# EAGLE design ATMEGA168 (EAGLE 6.4)
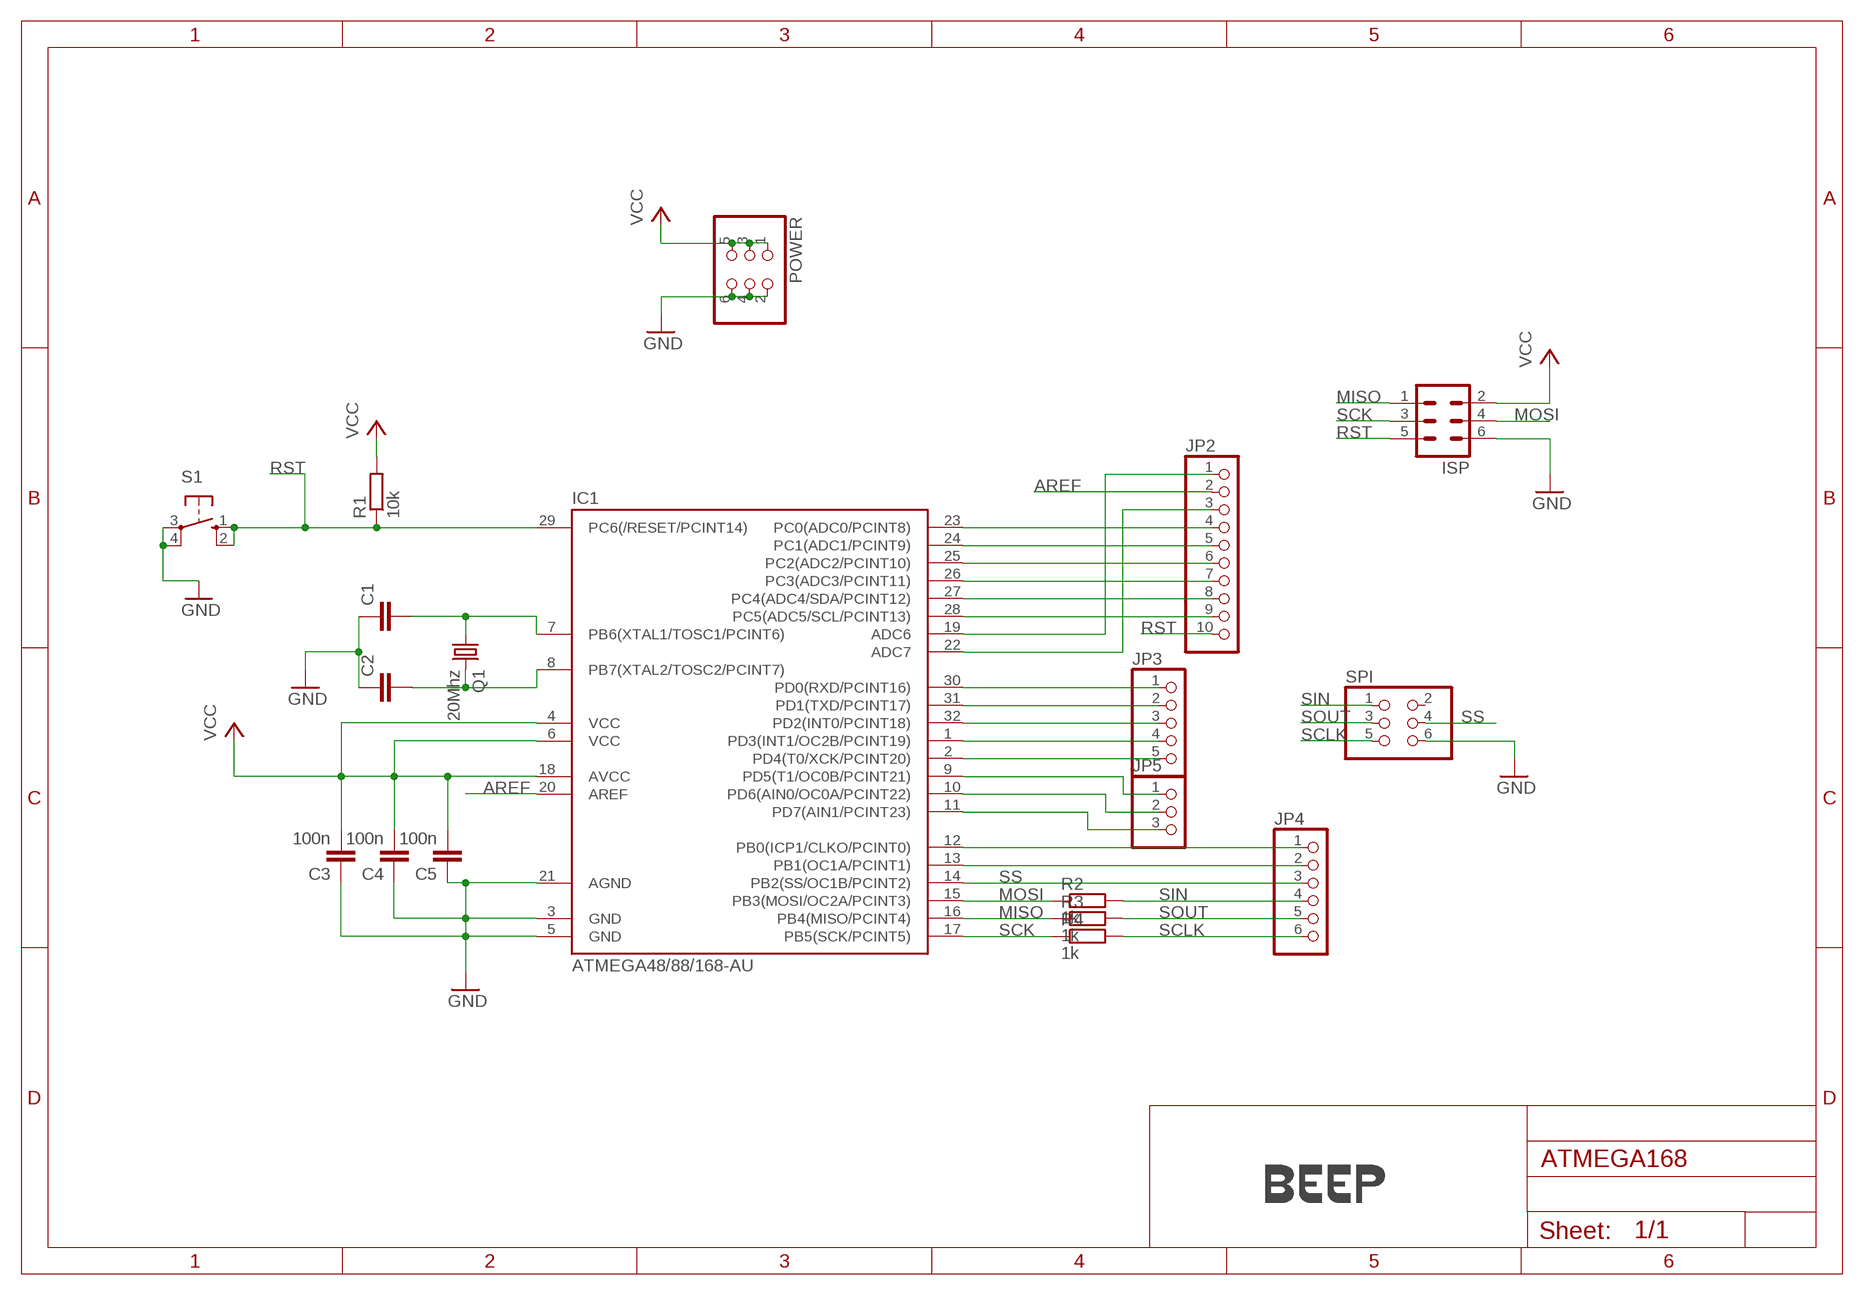
[diagram p0: schematic, sheet 1]

## Parts
C1  C-EUC0805  [C0805]
C2  C-EUC0805  [C0805]
C3  100n  C-EUC0805  [C0805]
C4  100n  C-EUC0805  [C0805]
C5  100n  C-EU050-025X075  [C050-025X075]
IC1  ATMEGA48/88/168-AU  [TQFP32-08]
ISP  ML6  [ML6]
JP2  PINHD-1X10  [1X10]
JP3  PINHD-1X5  [1X05]
JP4  PINHD-1X6  [1X06]
JP5  PINHD-1X3  [1X03]
POWER  PINHD-2X3  [2X03]
Q1  20Mhz  CRYSTALHC49S  [HC49/S]
R1  10k  R-EU_M0805  [M0805]
R2  1k  R-EU_0207/7  [0207/7]
R3  1k  R-EU_0207/7  [0207/7]
R4  1k  R-EU_0207/7  [0207/7]
S1  10-XX  [B3F-10XX]
SPI  PINHD-2X3  [2X03]
U$1  LOGO-COPPER4  [COPPER4]

## Nets
AREF: IC1.20(AREF) JP2.2
GND: C1.1 C2.1 C3.1 C4.1 C5.1 IC1.3(GND) IC1.5(GND) IC1.21(AGND) ISP.6 POWER.2 POWER.4 POWER.6 S1.3(P) S1.4(P1) SPI.6
MISO: IC1.16(PB4(MISO/PCINT4)) ISP.1 R3.1
MOSI: IC1.15(PB3(MOSI/OC2A/PCINT3)) ISP.4 R2.1
N$1: C1.2 IC1.7(PB6(XTAL1/TOSC1/PCINT6)) Q1.1
N$2: C2.2 IC1.8(PB7(XTAL2/TOSC2/PCINT7)) Q1.2
N$3: IC1.28(PC5(ADC5/SCL/PCINT13)) JP2.9
N$4: IC1.27(PC4(ADC4/SDA/PCINT12)) JP2.8
N$5: IC1.26(PC3(ADC3/PCINT11)) JP2.7
N$6: IC1.25(PC2(ADC2/PCINT10)) JP2.6
N$7: IC1.9(PD5(T1/OC0B/PCINT21)) JP5.1
N$8: IC1.10(PD6(AIN0/OC0A/PCINT22)) JP5.2
N$9: IC1.30(PD0(RXD/PCINT16)) JP3.1
N$10: IC1.31(PD1(TXD/PCINT17)) JP3.2
N$11: IC1.32(PD2(INT0/PCINT18)) JP3.3
N$12: IC1.1(PD3(INT1/OC2B/PCINT19)) JP3.4
N$13: IC1.2(PD4(T0/XCK/PCINT20)) JP3.5
N$14: IC1.11(PD7(AIN1/PCINT23)) JP5.3
N$15: IC1.24(PC1(ADC1/PCINT9)) JP2.5
N$16: IC1.23(PC0(ADC0/PCINT8)) JP2.4
N$17: IC1.12(PB0(ICP1/CLKO/PCINT0)) JP4.1
N$18: IC1.13(PB1(OC1A/PCINT1)) JP4.2
N$20: IC1.19(ADC6) JP2.1
N$21: IC1.22(ADC7) JP2.3
RST: IC1.29(PC6(/RESET/PCINT14)) ISP.5 JP2.10 R1.1 S1.1(S) S1.2(S1)
SCK: IC1.17(PB5(SCK/PCINT5)) ISP.3 R4.1
SCLK: JP4.6 R4.2 SPI.5
SIN: JP4.4 R2.2 SPI.1
SOUT: JP4.5 R3.2 SPI.3
SS: IC1.14(PB2(SS/OC1B/PCINT2)) JP4.3 SPI.4
VCC: C3.2 C4.2 C5.2 IC1.4(VCC) IC1.6(VCC) IC1.18(AVCC) ISP.2 POWER.1 POWER.3 POWER.5 R1.2
Unconnected: SPI.2

## Library data of the parts
C1-C5 = rcl:C-EU: CAPACITOR, European symbol
IC1 = atmega8:ATMEGA48/88/168
ISP = con-harting-ml:ML6: HARTING; OC_FARNELL: unknown; OC_NEWARK: unknown
JP2 = pinhead:PINHD-1X10: PIN HEADER
JP3 = pinhead:PINHD-1X5: PIN HEADER
JP4 = pinhead:PINHD-1X6: PIN HEADER
JP5 = pinhead:PINHD-1X3: PIN HEADER
POWER SPI = pinhead:PINHD-2X3: PIN HEADER
Q1 = crystal:CRYSTAL: CRYSTAL; OC_FARNELL: 1667008; OC_NEWARK: unknown
R1-R4 = rcl:R-EU_: RESISTOR, European symbol
S1 = switch-omron:10-XX: OMRON SWITCH; MPN: B3F-1000; OC_FARNELL: 176432; OC_NEWARK: 36M3542
U$1 = Branding:LOGO-COPPER

## Board
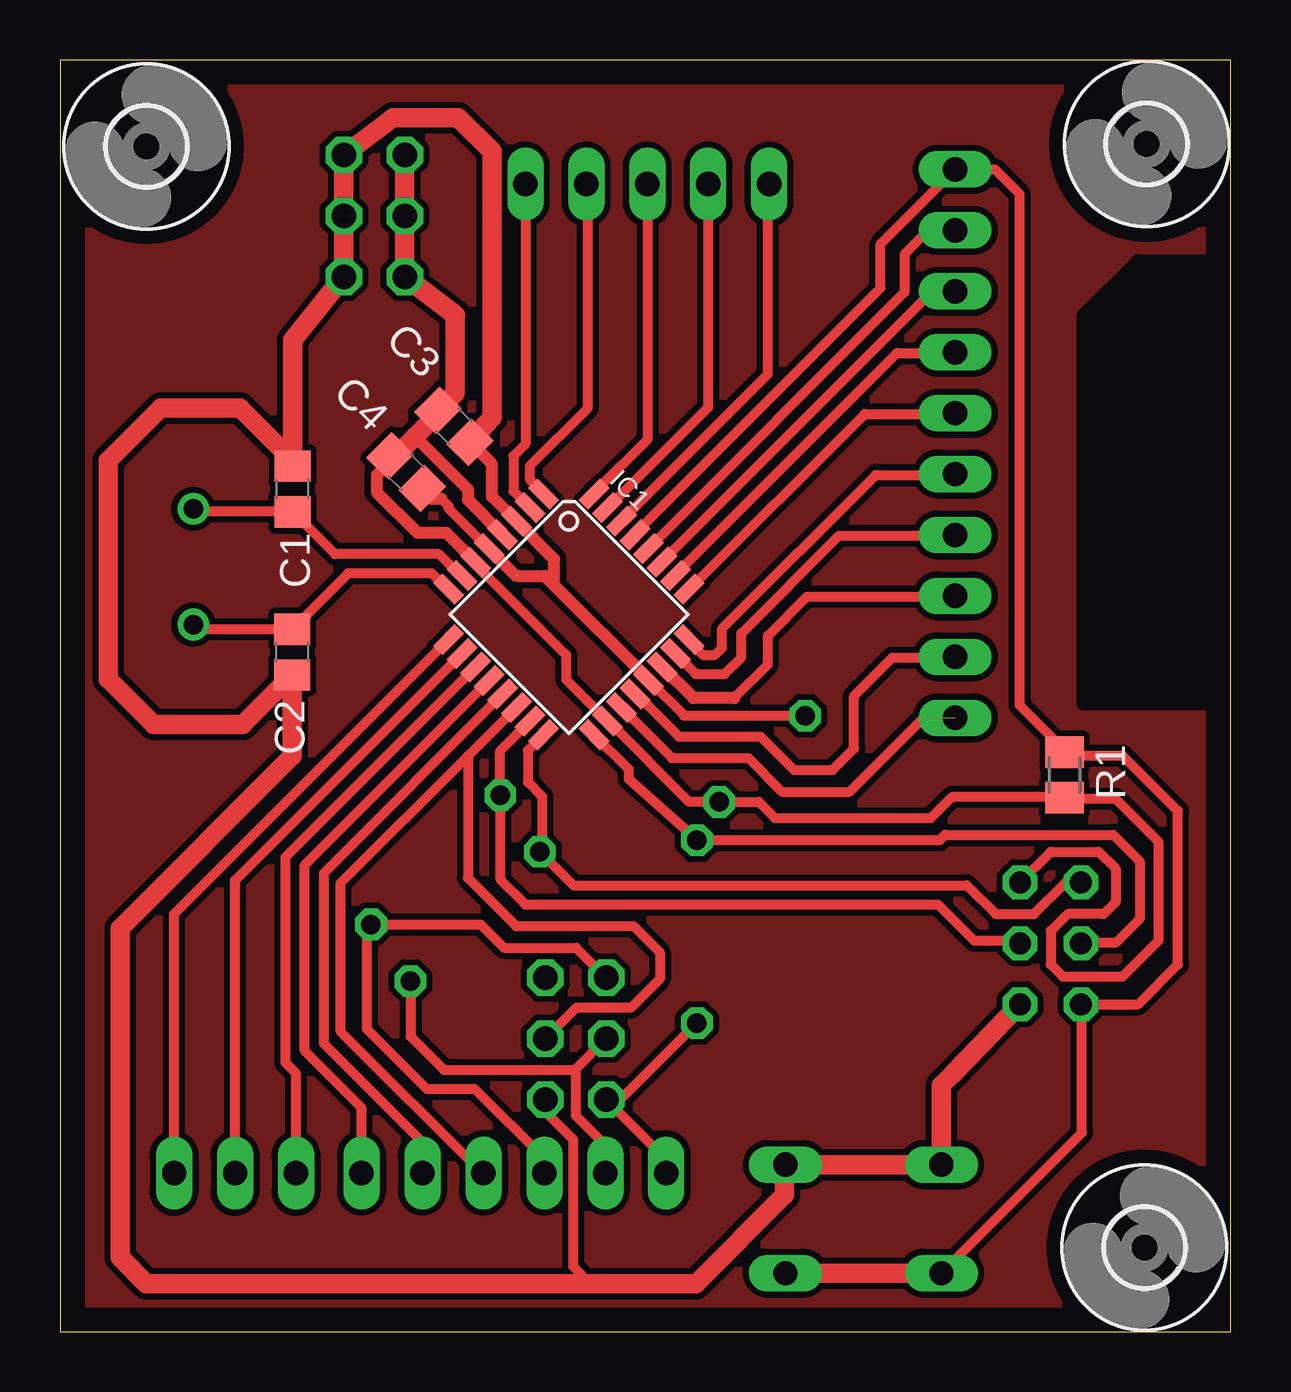
[diagram p1: board, top side]
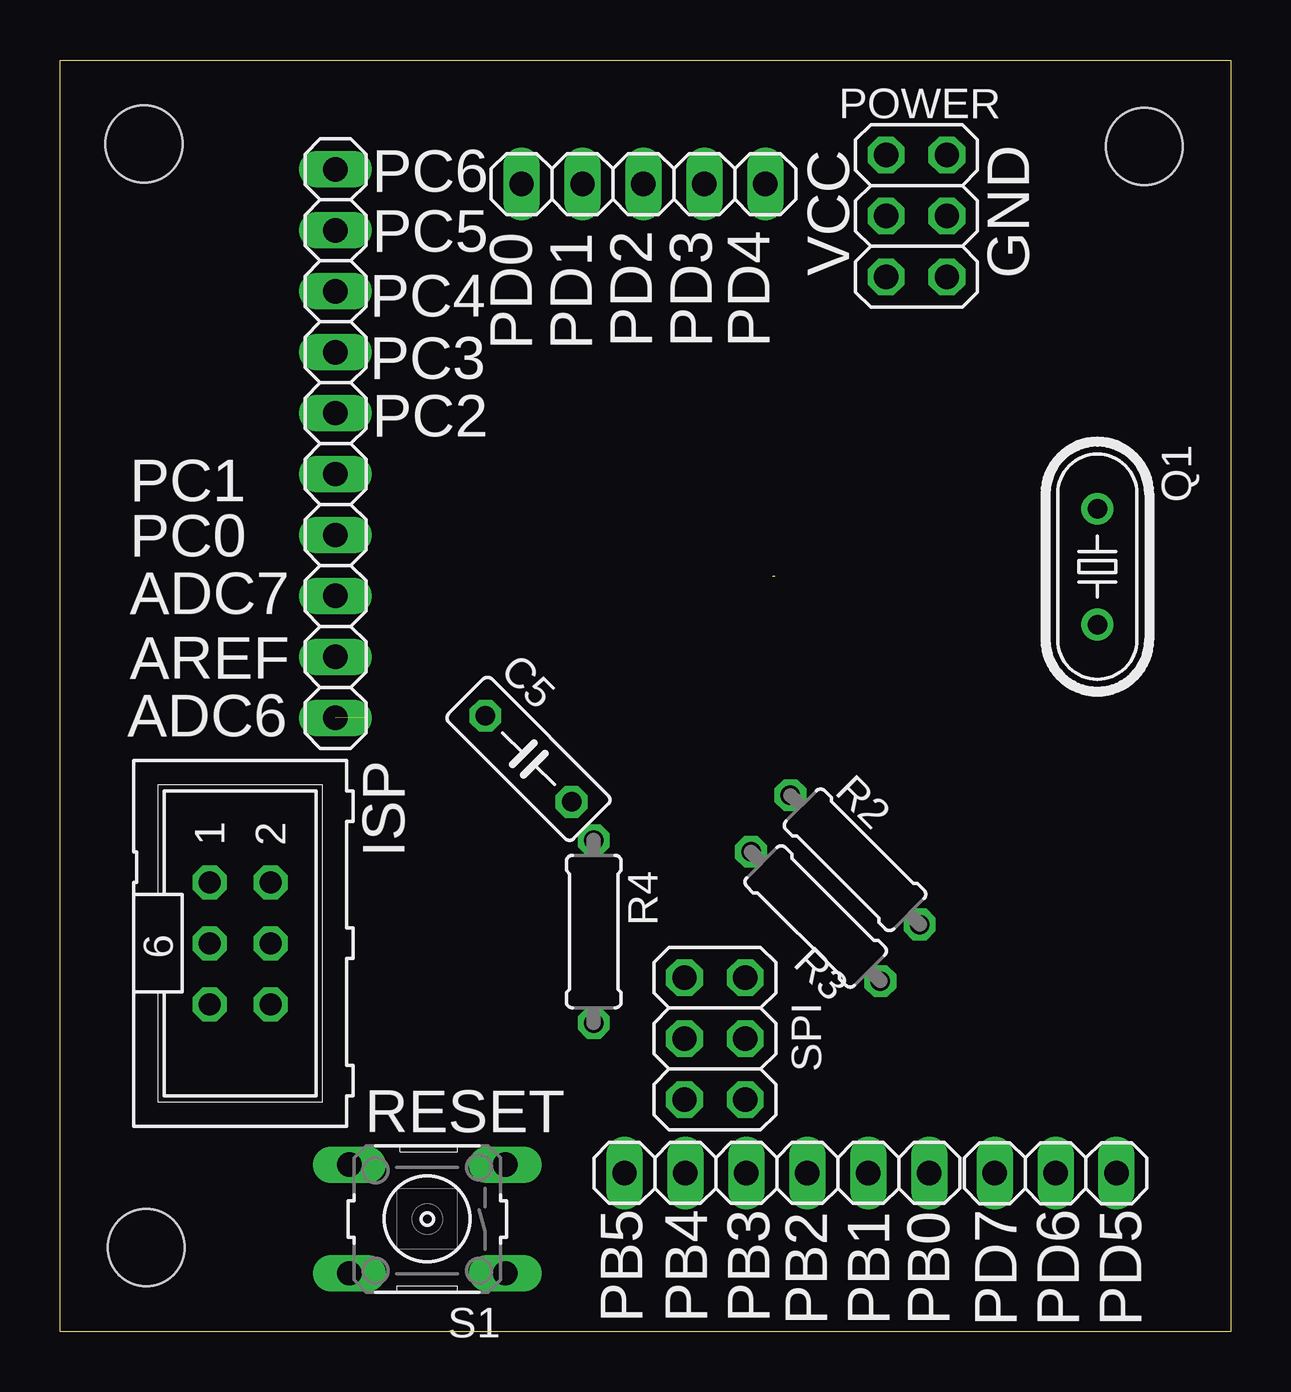
[diagram p2: board, bottom side, seen from below]

Size 48.8 x 53 mm. Coordinates in mm from the lower left corner, seen from the top.
Outline: 0,0 48.8,0 48.8,53 0,53 0,0
Copper layers (1*16): Top 0.035mm / dielectric 1.5mm / Bottom 0.035mm
Design rules "default *": minimum track width 10mil, minimum drill 24mil, track to track 10mil, track to pad 8mil, pad to pad 8mil, via to via 8mil, smd to smd 8mil, copper to edge 40mil, drill to drill 8mil, minimum pad ring 10mil, minimum via ring 8mil, stop-mask expansion 4mil, vias tented up to drill 0mil, thermal gap 10mil
tRestrict: area 42.6,26.1 to 47.9,44.7

### Footprints (pad centres in the part's own frame; a part is rotated, then mirrored left to right if it is on the bottom)
C0805 = smd 1.3 x 1.5: 1 -0.95,0; 2 0.95,0
C050-025X075 = drill 0.813 octagon: 1 -2.54,0; 2 2.54,0
3,2 = hole 3.2: 0,0
TQFP32-08 = smd 1.27 x 0.559: 1 -4.293,2.8; 2 -4.293,2; 3 -4.293,1.2; 4 -4.293,0.4; 5 -4.293,-0.4; 6 -4.293,-1.2; 7 -4.293,-2; 8 -4.293,-2.8; 17 4.293,-2.8; 18 4.293,-2; 19 4.293,-1.2; 20 4.293,-0.4; 21 4.293,0.4; 22 4.293,1.2; 23 4.293,2; 24 4.293,2.8 | smd 0.559 x 1.27: 9 -2.8,-4.293; 10 -2,-4.293; 11 -1.2,-4.293; 12 -0.4,-4.293; 13 0.4,-4.293; 14 1.2,-4.293; 15 2,-4.293; 16 2.8,-4.293; 25 2.8,4.293; 26 2,4.293; 27 1.2,4.293; 28 0.4,4.293; 29 -0.4,4.293; 30 -1.2,4.293; 31 -2,4.293; 32 -2.8,4.293
ML6 = drill 0.914 octagon: 1 -2.54,-1.27; 2 -2.54,1.27; 3 0,-1.27; 4 0,1.27; 5 2.54,-1.27; 6 2.54,1.27
1X10 = drill 1.016 long: 1 -11.43,0; 2 -8.89,0; 3 -6.35,0; 4 -3.81,0; 5 -1.27,0; 6 1.27,0; 7 3.81,0; 8 6.35,0; 9 8.89,0; 10 11.43,0
1X05 = drill 1.016 long: 1 -5.08,0; 2 -2.54,0; 3 0,0; 4 2.54,0; 5 5.08,0
1X06 = drill 1.016 long: 1 -6.35,0; 2 -3.81,0; 3 -1.27,0; 4 1.27,0; 5 3.81,0; 6 6.35,0
1X03 = drill 1.016 long: 1 -2.54,0; 2 0,0; 3 2.54,0
2X03 = drill 1.016 octagon: 1 -2.54,-1.27; 2 -2.54,1.27; 3 0,-1.27; 4 0,1.27; 5 2.54,-1.27; 6 2.54,1.27
HC49/S = drill 0.813: 1 -2.413,0; 2 2.413,0
M0805 = smd 1.3 x 1.6: 1 -0.95,0; 2 0.95,0
0207/7 = drill 0.813 octagon: 1 -3.81,0; 2 3.81,0
B3F-10XX = drill 1.016 long: 1 -3.251,2.261; 2 3.251,2.261; 3 -3.251,-2.261; 4 3.251,-2.261

### Placement (x,y rotation side)
C1  9.69,35.12 270 top
C2  9.68,28.32 90 top
C3  16.42,37.73 135 top
C4  14.43,35.82 135 top
C5  29.27,23.87 315 bottom
H1  [3,2]  3.6,49.4 0 top
H2  [3,2]  45.3,49.5 0 top
H3  [3,2]  45.2,3.5 0 top
IC1  21.21,29.89 315 top
ISP  41.29,16.18 270 bottom
JP2  37.32,37.01 90 bottom
JP3  24.48,47.83 0 bottom
JP4  18.92,6.61 180 bottom
JP5  7.3,6.6 180 bottom
POWER  13.1,46.5 270 bottom
Q1  5.56,31.88 270 bottom
R1  41.87,23.2 270 top
R2  15.66,19.66 315 bottom
R3  17.3,17.3 315 bottom
R4  26.55,16.67 270 bottom
S1  33.49,4.69 180 bottom
SPI  21.5,12.21 270 bottom
U$1  47.7,37.7 90 top

### Tracks (layer width: path | path; a pad name or v marks a point on that pad's centre or on a via)
AREF
  Top 0.406: IC1.20 24.03,26.57 25.8,24.8 29.2,24.8 30.6,23.4 32.2,23.4 33.1,24.3 33.1,26.5 34.69,28.09 37.29,28.09 JP2.2
GND  (1 unrouted)
  Top 0.406: IC1.21 24.56,27.14 26,25.7 26,25.67 C5.1 | C3.1 17.09,37.09 | C1.1 9.69,36.31 | 22.1,2 21.4,2.7 21.4,8 20.3,9.1 20.3,9.6 SPI.6 | IC1.5 17.86,32.64 16.2,34.3 16.2,34.4 15.9,34.7
  Top 0.508: C3.1 18,36.15 18,34.8 IC1.3 20.6,32.2 20.6,31.1 | 15.9,34.7 15.45,34.7 C4.1 | IC1.5 17.89,32.61 19,31.5 | IC1.21 24.53,27.17 20.6,31.1 | 19.1,31.5 20.2,31.5 20.6,31.1
  Top 0.813: 17.09,37.09 18,38.1 18,49.2 16.6,50.6 13.89,50.6 POWER.2 POWER.4 POWER.6 9.69,41.32 C1.1 | ISP.6 37.22,10.74 36.74,10.26 S1.4 S1.3 30.2,6.91 30.2,5.7 26.5,2 22.1,2 3.6,2 2.5,3.1 2.5,16.8 9.68,23.98 C2.1 7.61,25.3 3.9,25.3 2,27.2 2,36.3 4.2,38.5 7.5,38.5 9.69,36.31
MISO
  Top 0.406: IC1.16 19.5,24.22 19.5,22.9 20.1,22.3 20.1,20.1 R3.1 20.01,19.99 21.4,18.6 37.8,18.6 39,17.4 40.6,17.4 41.9,18.7 42.54,18.7 ISP.1
MOSI
  Top 0.406: 19.59,25.39 IC1.15 18.35,24.21 R2.1 18.35,18.85 19.4,17.8 36.6,17.8 38.1,16.3 39.9,16.3 ISP.4 40,16.2
N$1
  Top 0.406: IC1.7 16.69,31.51 15.8,32.4 11.46,32.4 C1.2 5.68,34.17 Q1.1
N$2
  Top 0.406: IC1.8 16.16,30.95 15.5,31.6 12.01,31.6 C2.2 5.76,29.27 Q1.2
N$3
  Top 0.406: 24.59,32.79 24.59,32.64 IC1.28 35.2,43.31 35.2,44.9 36.2,45.9 JP2.9
N$4
  Top 0.406: IC1.27 25.09,32.09 36.2,43.2 37.16,43.2 JP2.8
N$5
  Top 0.406: IC1.26 25.66,31.56 34.9,40.8 34.91,40.79 37.29,40.79 JP2.7
N$6
  Top 0.406: IC1.25 26.25,30.95 33.55,38.25 37.29,38.25 JP2.6
N$7
  Top 0.406: JP5.1 4.76,17.4 IC1.9
N$8
  Top 0.406: JP5.2 7.3,18.81 IC1.10
N$9
  Top 0.406: 23.4,33.8 29.5,39.9 29.5,47.77 JP3.1
  Top 0.508: IC1.30 23.4,33.8
N$10
  Top 0.406: IC1.31 26.35,37.85 26.6,38.1 27.02,38.52 JP3.2
  Top 0.508: IC1.31
N$11
  Top 0.406: 22.27,34.97 22.36,34.97 22.36,35.06 24.5,37.2 24.5,47.81 JP3.3
  Top 0.508: IC1.32 22.27,34.97
N$12
  Top 0.406: 20.16,34.95 19.6,35.5 19.6,36.1 22,38.5 22,47.77 JP3.4
  Top 0.508: IC1.1 20.16,34.95
N$13
  Top 0.406: JP3.5 19.4,37 18.9,36.5 18.9,35.03 IC1.2
N$14
  Top 0.406: JP5.3 9.84,10.76 9.4,11.2 9.4,19.78 IC1.11
N$15
  Top 0.406: IC1.24 26.23,28.77 26.8,28.2 27.3,28.2 27.6,28.5 27.6,29.3 34,35.7 37.28,35.7 JP2.5
N$16
  Top 0.406: IC1.23 25.66,28.24 26.5,27.4 27.7,27.4 28.4,28.1 28.4,29.1 32.47,33.17 37.29,33.17 JP2.4
N$17
  Top 0.406: IC1.12 10.2,19.45 10.2,11.7 12.57,9.33 JP4.1
N$18
  Top 0.406: JP4.2 15.11,7.89 11,12 11,19.11 IC1.13
N$19
  pour Top: 0,0 48.8,0 48.8,53 0,53
N$20  (1 unrouted)
  Top 0.406: IC1.19 25.5,23.9 28.7,23.9 30.1,22.5 32.9,22.5 36,25.6
N$21
  Top 0.406: 28.1,26.4 29.5,27.8 29.5,29 31.13,30.63 37.29,30.63 JP2.3
  Top 0.508: 28.1,26.4 26.4,26.4 IC1.22
RST
  Top 0.406: 23.96,33.26 34.2,43.5 34.2,45.32 JP2.10 38.96,48.44 40,47.4 40,26.1 41.87,24.23 R1.1 42.02,24 44.3,24 46.6,21.7 46.6,15.3 44.94,13.64 ISP.5 42.6,13.6 42.6,8.29 S1.2
  Top 0.508: IC1.29 23.96,33.26
  Top 0.813: S1.1 S1.2
SCK
  Top 0.406: IC1.17 23.7,23.44 23.7,23.03 R4.1 36.68,20.48 36.9,20.7 43.9,20.7 45,19.6 45,17.2 44,16.2 42.58,16.2 ISP.3
SCLK
  Top 0.406: JP4.6 25.27,7.17 SPI.5 23.36,9.67 R4.2
SIN
  Top 0.406: SPI.1 21.52,16 18.5,16 17.53,16.97 R2.2 12.8,16.8 12.8,12.6 15.3,10.1 17.3,10.1 20.19,7.21 JP4.4
SOUT
  Top 0.406: R3.2 14.61,12.29 16,10.9 21.46,10.9 | 21.46,10.9 SPI.3 | JP4.5 22.73,7.77 21.5,9 21.5,10.86 21.46,10.9
SS
  Top 0.406: 19.01,26.01 IC1.14 17.02,24 17,24 | JP4.3 17.65,6.55 11.7,12.5 11.7,18.7 17,24 | 17,24 17,18.9 19,16.9 23.9,16.9 25,15.8 25,14.7 23.8,13.5 21.52,13.5 SPI.4
VCC
  Top 0.406: IC1.6 17.33,31.97 21.1,28.2 21.1,27.17 IC1.18 22.86,25.44 26.23,22.07 C5.2 29.13,22.07 29.8,21.4 36.3,21.4 37.2,22.3 41.82,22.3 R1.2 41.92,22.2 44,22.2 45.8,20.4 45.8,16.3 44.3,14.8 41.8,14.8 41.3,15.3 41.3,16.7 42,17.4 43.5,17.4 44,17.9 44,19.3 43.3,20 41.3,20 ISP.2
  Top 0.508: IC1.18 22.83,25.37 | C3.2 15.75,38.25 | 14.8,37.3 17,35.1 17,34.67 IC1.4 | IC1.6 16.1,33.3 14.9,33.3 13.2,35 13.2,35.7 13.76,36.26 C4.2 14.09,36.59
  Top 0.813: 15.75,38.25 14.8,37.3 14.09,36.59 | C3.2 16.47,39.12 16.47,42.36 | POWER.5 POWER.3 POWER.1
  Top 0.843: 16.47,42.36 POWER.5

### Text on the board
bNames: PC6 | PD4 | PD3 | PD2 | PD1 | PD0 | PC5 | GND | VCC | PC4 | PC3 | PC2 | PC1 | PC0 | ADC7 | AREF | ADC6 | RESET | PD5 | PD6 | PD7 | PB0 | PB1 | PB2 | PB3 | PB4 | PB5
tCName: ATmega168 / v0.1.1